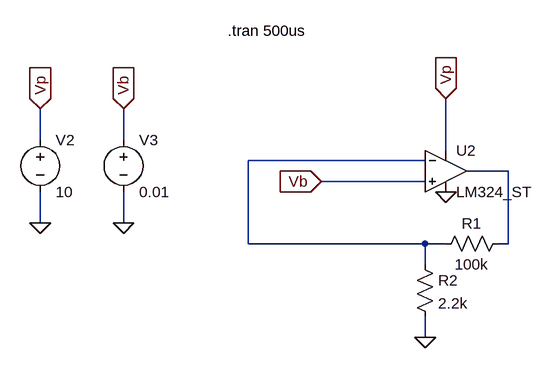
[diagram p0: schematic Opamp Amplifier.asc]
Opamp Amplifier.asc, the LTspice schematic file:
Version 4
SHEET 1 1332 680
WIRE -416 0 -416 -48
WIRE -288 0 -288 -48
WIRE 208 16 208 -64
WIRE 176 32 -96 32
WIRE 304 48 240 48
WIRE 176 64 16 64
WIRE -416 128 -416 80
WIRE -288 128 -288 80
WIRE -96 160 -96 32
WIRE 176 160 -96 160
WIRE 208 160 176 160
WIRE 304 160 304 48
WIRE 304 160 288 160
WIRE 176 192 176 160
WIRE 176 304 176 272
FLAG 16 64 Vb
IOPIN 16 64 In
FLAG -416 128 0
FLAG -416 -48 Vp
IOPIN -416 -48 In
FLAG 208 80 0
FLAG -288 128 0
FLAG -288 -48 Vb
IOPIN -288 -48 In
FLAG 208 -64 Vp
IOPIN 208 -64 In
FLAG 176 304 0
SYMBOL voltage -416 -16 R0
WINDOW 123 0 0 Left 0
WINDOW 39 0 0 Left 0
SYMATTR InstName V2
SYMATTR Value 10
SYMBOL voltage -288 -16 R0
WINDOW 123 0 0 Left 0
WINDOW 39 0 0 Left 0
SYMATTR InstName V3
SYMATTR Value 0.01
SYMBOL EXTRA\\ExtraOpamps\\LM324_ST 208 48 R0
SYMATTR InstName U2
SYMBOL res 304 144 R90
WINDOW 0 0 56 VBottom 2
WINDOW 3 32 56 VTop 2
SYMATTR InstName R1
SYMATTR Value 100k
SYMBOL res 160 176 R0
SYMATTR InstName R2
SYMATTR Value 2.2k
TEXT -128 -168 Left 2 !.tran 500us

The netlist it stands for:
* Opamp Amplifier.asc
V2 Vp 0 10
V3 Vb 0 0.01
* U2: LM324_ST (symbol EXTRA\ExtraOpamps\LM324_ST not available, pins judged from their places): In+=Vb In-=N001 V+=Vp V-=0 OUT=N002
R1 N002 N001 100k
R2 N001 0 2.2k
.tran 500us
.backanno
.end